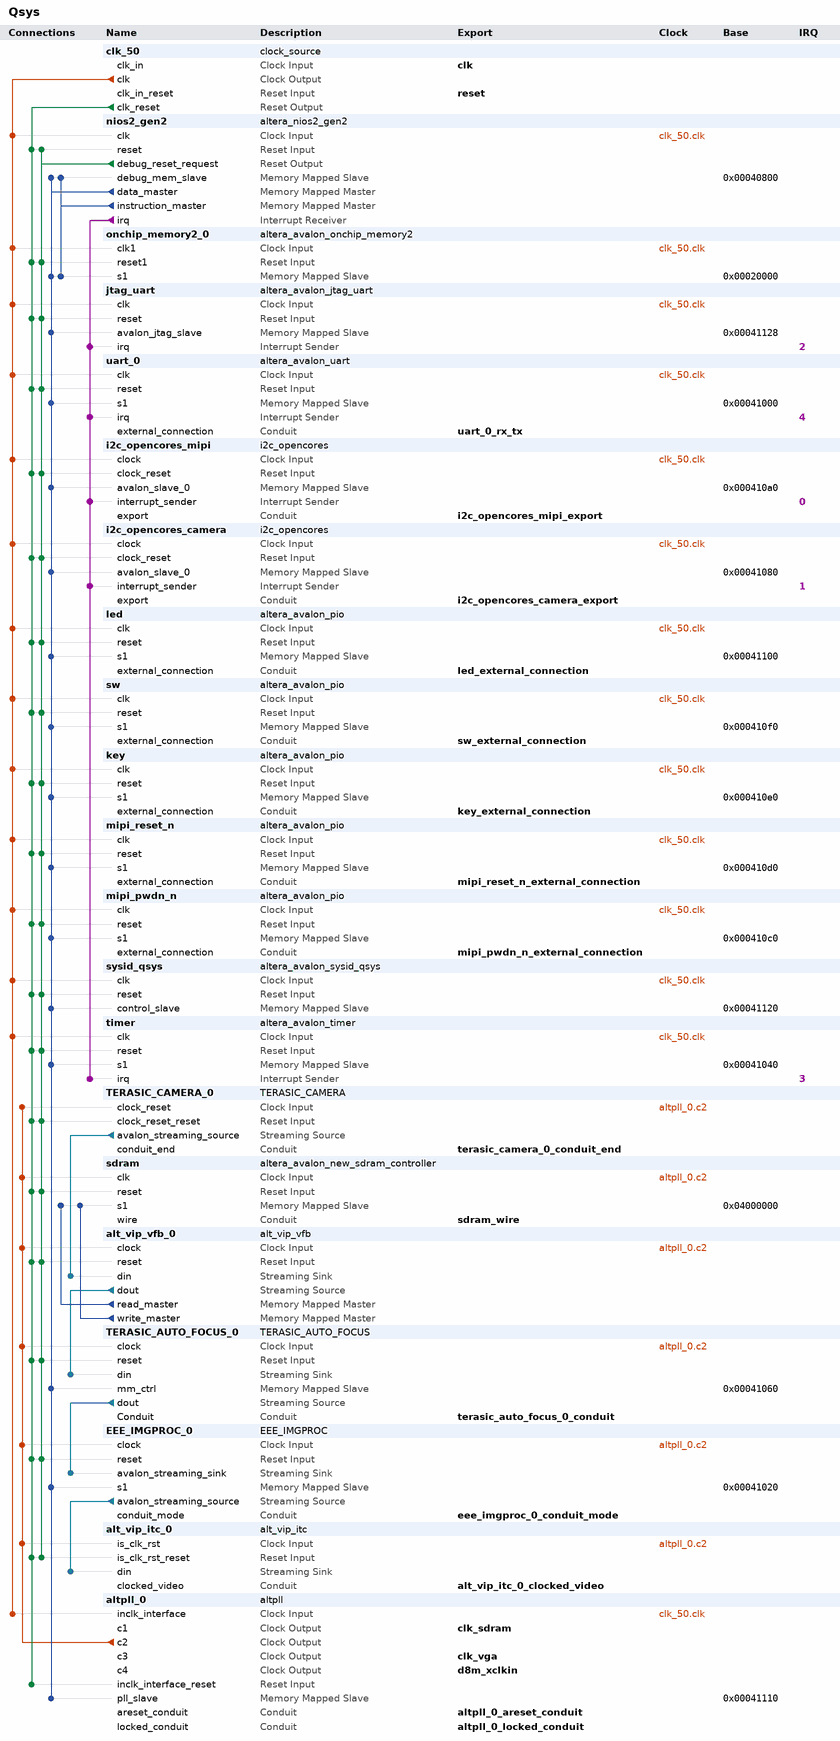
[diagram p0: system contents]
# Platform Designer (Qsys) system Qsys, MAX 10 10M50DAF484C7G
# Parameters at their usual value, and those the tool derives, are not listed.
package require -exact qsys 18.0
create_system Qsys
set_project_property DEVICE_FAMILY {MAX 10}
set_project_property DEVICE 10M50DAF484C7G

add_instance clk_50 clock_source 18.0
set_instance_parameter_value clk_50 clockFrequency 50000000

add_instance nios2_gen2 altera_nios2_gen2 18.0
set_instance_parameter_value nios2_gen2 dcache_size 2048
set_instance_parameter_value nios2_gen2 exceptionSlave onchip_memory2_0.s1
set_instance_parameter_value nios2_gen2 icache_size 4096
set_instance_parameter_value nios2_gen2 impl Fast
set_instance_parameter_value nios2_gen2 resetSlave onchip_memory2_0.s1

add_instance onchip_memory2_0 altera_avalon_onchip_memory2 18.0
set_instance_parameter_value onchip_memory2_0 dataWidth 32
set_instance_parameter_value onchip_memory2_0 dualPort false
set_instance_parameter_value onchip_memory2_0 initMemContent true
set_instance_parameter_value onchip_memory2_0 initializationFileName Qsys_onchip_memory2_0.hex
set_instance_parameter_value onchip_memory2_0 memorySize 131072
set_instance_parameter_value onchip_memory2_0 useNonDefaultInitFile true

add_instance jtag_uart altera_avalon_jtag_uart 18.0
set_instance_parameter_value jtag_uart simInteractiveOptions NO_INTERACTIVE_WINDOWS

add_instance uart_0 altera_avalon_uart 18.0
set_instance_parameter_value uart_0 baud 38400
set_instance_parameter_value uart_0 dataBits 8
set_instance_parameter_value uart_0 fixedBaud true
set_instance_parameter_value uart_0 parity NONE
set_instance_parameter_value uart_0 stopBits 1

add_instance i2c_opencores_mipi i2c_opencores 12.0

add_instance i2c_opencores_camera i2c_opencores 12.0

add_instance led altera_avalon_pio 18.0
set_instance_parameter_value led direction Output
set_instance_parameter_value led width 10

add_instance sw altera_avalon_pio 18.0
set_instance_parameter_value sw direction Input
set_instance_parameter_value sw width 10

add_instance key altera_avalon_pio 18.0
set_instance_parameter_value key direction Input
set_instance_parameter_value key width 2

add_instance mipi_reset_n altera_avalon_pio 18.0
set_instance_parameter_value mipi_reset_n direction Output
set_instance_parameter_value mipi_reset_n width 1

add_instance mipi_pwdn_n altera_avalon_pio 18.0
set_instance_parameter_value mipi_pwdn_n direction Output
set_instance_parameter_value mipi_pwdn_n width 1

add_instance sysid_qsys altera_avalon_sysid_qsys 18.0
set_instance_parameter_value sysid_qsys id 0

add_instance timer altera_avalon_timer 18.0
set_instance_parameter_value timer period 1
set_instance_parameter_value timer periodUnits MSEC

add_instance TERASIC_CAMERA_0 TERASIC_CAMERA 1.0

add_instance sdram altera_avalon_new_sdram_controller 18.0
set_instance_parameter_value sdram TAC 5.5
set_instance_parameter_value sdram TRCD 20.0
set_instance_parameter_value sdram TRP 20.0
set_instance_parameter_value sdram casLatency 3
set_instance_parameter_value sdram columnWidth 10
set_instance_parameter_value sdram dataWidth 16
set_instance_parameter_value sdram generateSimulationModel true
set_instance_parameter_value sdram model single_Micron_MT48LC4M32B2_7_chip
set_instance_parameter_value sdram numberOfBanks 4
set_instance_parameter_value sdram numberOfChipSelects 1
set_instance_parameter_value sdram powerUpDelay 100.0
set_instance_parameter_value sdram refreshPeriod 15.625
set_instance_parameter_value sdram rowWidth 13

add_instance alt_vip_vfb_0 alt_vip_vfb 13.1

add_instance TERASIC_AUTO_FOCUS_0 TERASIC_AUTO_FOCUS 1.0

add_instance EEE_IMGPROC_0 EEE_IMGPROC 1.0

add_instance alt_vip_itc_0 alt_vip_itc 14.0
set_instance_parameter_value alt_vip_itc_0 FIFO_DEPTH 640
set_instance_parameter_value alt_vip_itc_0 H_ACTIVE_PIXELS 640
set_instance_parameter_value alt_vip_itc_0 H_BACK_PORCH 48
set_instance_parameter_value alt_vip_itc_0 H_FRONT_PORCH 16
set_instance_parameter_value alt_vip_itc_0 H_SYNC_LENGTH 96
set_instance_parameter_value alt_vip_itc_0 NUMBER_OF_COLOUR_PLANES 3
set_instance_parameter_value alt_vip_itc_0 THRESHOLD 639
set_instance_parameter_value alt_vip_itc_0 V_ACTIVE_LINES 480
set_instance_parameter_value alt_vip_itc_0 V_BACK_PORCH 33
set_instance_parameter_value alt_vip_itc_0 V_FRONT_PORCH 10
set_instance_parameter_value alt_vip_itc_0 V_SYNC_LENGTH 2

add_instance altpll_0 altpll 18.0
set_instance_parameter_value altpll_0 CLK0_DIVIDE_BY 1
set_instance_parameter_value altpll_0 CLK0_MULTIPLY_BY 2
set_instance_parameter_value altpll_0 CLK1_DIVIDE_BY 1
set_instance_parameter_value altpll_0 CLK1_DUTY_CYCLE 50
set_instance_parameter_value altpll_0 CLK1_MULTIPLY_BY 2
set_instance_parameter_value altpll_0 CLK1_PHASE_SHIFT 7500
set_instance_parameter_value altpll_0 CLK2_DIVIDE_BY 1
set_instance_parameter_value altpll_0 CLK2_DUTY_CYCLE 50
set_instance_parameter_value altpll_0 CLK2_MULTIPLY_BY 2
set_instance_parameter_value altpll_0 CLK2_PHASE_SHIFT 0
set_instance_parameter_value altpll_0 CLK3_DIVIDE_BY 2
set_instance_parameter_value altpll_0 CLK3_DUTY_CYCLE 50
set_instance_parameter_value altpll_0 CLK3_MULTIPLY_BY 1
set_instance_parameter_value altpll_0 CLK3_PHASE_SHIFT 0
set_instance_parameter_value altpll_0 CLK4_DIVIDE_BY 5
set_instance_parameter_value altpll_0 CLK4_DUTY_CYCLE 50
set_instance_parameter_value altpll_0 CLK4_MULTIPLY_BY 2
set_instance_parameter_value altpll_0 CLK4_PHASE_SHIFT 0
set_instance_parameter_value altpll_0 INCLK0_INPUT_FREQUENCY 20000
set_instance_parameter_value altpll_0 PORT_ARESET PORT_USED
set_instance_parameter_value altpll_0 PORT_LOCKED PORT_USED
set_instance_parameter_value altpll_0 PORT_clk1 PORT_USED
set_instance_parameter_value altpll_0 PORT_clk2 PORT_USED
set_instance_parameter_value altpll_0 PORT_clk3 PORT_USED
set_instance_parameter_value altpll_0 PORT_clk4 PORT_USED

# connections
add_connection altpll_0.c2 alt_vip_itc_0.is_clk_rst clock
add_connection altpll_0.c2 alt_vip_vfb_0.clock clock
add_connection altpll_0.c2 EEE_IMGPROC_0.clock clock
add_connection altpll_0.c2 sdram.clk clock
add_connection altpll_0.c2 TERASIC_AUTO_FOCUS_0.clock clock
add_connection altpll_0.c2 TERASIC_CAMERA_0.clock_reset clock
add_connection clk_50.clk altpll_0.inclk_interface clock
add_connection clk_50.clk i2c_opencores_camera.clock clock
add_connection clk_50.clk i2c_opencores_mipi.clock clock
add_connection clk_50.clk jtag_uart.clk clock
add_connection clk_50.clk key.clk clock
add_connection clk_50.clk led.clk clock
add_connection clk_50.clk mipi_pwdn_n.clk clock
add_connection clk_50.clk mipi_reset_n.clk clock
add_connection clk_50.clk nios2_gen2.clk clock
add_connection clk_50.clk onchip_memory2_0.clk1 clock
add_connection clk_50.clk sw.clk clock
add_connection clk_50.clk sysid_qsys.clk clock
add_connection clk_50.clk timer.clk clock
add_connection clk_50.clk uart_0.clk clock
add_connection clk_50.clk_reset alt_vip_itc_0.is_clk_rst_reset reset
add_connection clk_50.clk_reset alt_vip_vfb_0.reset reset
add_connection clk_50.clk_reset altpll_0.inclk_interface_reset reset
add_connection clk_50.clk_reset EEE_IMGPROC_0.reset reset
add_connection clk_50.clk_reset i2c_opencores_camera.clock_reset reset
add_connection clk_50.clk_reset i2c_opencores_mipi.clock_reset reset
add_connection clk_50.clk_reset jtag_uart.reset reset
add_connection clk_50.clk_reset key.reset reset
add_connection clk_50.clk_reset led.reset reset
add_connection clk_50.clk_reset mipi_pwdn_n.reset reset
add_connection clk_50.clk_reset mipi_reset_n.reset reset
add_connection clk_50.clk_reset nios2_gen2.reset reset
add_connection clk_50.clk_reset onchip_memory2_0.reset1 reset
add_connection clk_50.clk_reset sdram.reset reset
add_connection clk_50.clk_reset sw.reset reset
add_connection clk_50.clk_reset sysid_qsys.reset reset
add_connection clk_50.clk_reset TERASIC_AUTO_FOCUS_0.reset reset
add_connection clk_50.clk_reset TERASIC_CAMERA_0.clock_reset_reset reset
add_connection clk_50.clk_reset timer.reset reset
add_connection clk_50.clk_reset uart_0.reset reset
add_connection nios2_gen2.debug_reset_request alt_vip_itc_0.is_clk_rst_reset reset
add_connection nios2_gen2.debug_reset_request alt_vip_vfb_0.reset reset
add_connection nios2_gen2.debug_reset_request EEE_IMGPROC_0.reset reset
add_connection nios2_gen2.debug_reset_request i2c_opencores_camera.clock_reset reset
add_connection nios2_gen2.debug_reset_request i2c_opencores_mipi.clock_reset reset
add_connection nios2_gen2.debug_reset_request jtag_uart.reset reset
add_connection nios2_gen2.debug_reset_request key.reset reset
add_connection nios2_gen2.debug_reset_request led.reset reset
add_connection nios2_gen2.debug_reset_request mipi_pwdn_n.reset reset
add_connection nios2_gen2.debug_reset_request mipi_reset_n.reset reset
add_connection nios2_gen2.debug_reset_request nios2_gen2.reset reset
add_connection nios2_gen2.debug_reset_request onchip_memory2_0.reset1 reset
add_connection nios2_gen2.debug_reset_request sdram.reset reset
add_connection nios2_gen2.debug_reset_request sw.reset reset
add_connection nios2_gen2.debug_reset_request sysid_qsys.reset reset
add_connection nios2_gen2.debug_reset_request TERASIC_AUTO_FOCUS_0.reset reset
add_connection nios2_gen2.debug_reset_request TERASIC_CAMERA_0.clock_reset_reset reset
add_connection nios2_gen2.debug_reset_request timer.reset reset
add_connection nios2_gen2.debug_reset_request uart_0.reset reset
add_connection alt_vip_vfb_0.read_master sdram.s1 avalon
set_connection_parameter_value alt_vip_vfb_0.read_master/sdram.s1 arbitrationPriority 50
set_connection_parameter_value alt_vip_vfb_0.read_master/sdram.s1 baseAddress 0x04000000
add_connection alt_vip_vfb_0.write_master sdram.s1 avalon
set_connection_parameter_value alt_vip_vfb_0.write_master/sdram.s1 arbitrationPriority 30
set_connection_parameter_value alt_vip_vfb_0.write_master/sdram.s1 baseAddress 0x04000000
add_connection nios2_gen2.data_master altpll_0.pll_slave avalon
set_connection_parameter_value nios2_gen2.data_master/altpll_0.pll_slave baseAddress 0x00041110
add_connection nios2_gen2.data_master EEE_IMGPROC_0.s1 avalon
set_connection_parameter_value nios2_gen2.data_master/EEE_IMGPROC_0.s1 baseAddress 0x00041020
add_connection nios2_gen2.data_master i2c_opencores_camera.avalon_slave_0 avalon
set_connection_parameter_value nios2_gen2.data_master/i2c_opencores_camera.avalon_slave_0 baseAddress 0x00041080
add_connection nios2_gen2.data_master i2c_opencores_mipi.avalon_slave_0 avalon
set_connection_parameter_value nios2_gen2.data_master/i2c_opencores_mipi.avalon_slave_0 baseAddress 0x000410a0
add_connection nios2_gen2.data_master jtag_uart.avalon_jtag_slave avalon
set_connection_parameter_value nios2_gen2.data_master/jtag_uart.avalon_jtag_slave baseAddress 0x00041128
add_connection nios2_gen2.data_master key.s1 avalon
set_connection_parameter_value nios2_gen2.data_master/key.s1 baseAddress 0x000410e0
add_connection nios2_gen2.data_master led.s1 avalon
set_connection_parameter_value nios2_gen2.data_master/led.s1 baseAddress 0x00041100
add_connection nios2_gen2.data_master mipi_pwdn_n.s1 avalon
set_connection_parameter_value nios2_gen2.data_master/mipi_pwdn_n.s1 baseAddress 0x000410c0
add_connection nios2_gen2.data_master mipi_reset_n.s1 avalon
set_connection_parameter_value nios2_gen2.data_master/mipi_reset_n.s1 baseAddress 0x000410d0
add_connection nios2_gen2.data_master nios2_gen2.debug_mem_slave avalon
set_connection_parameter_value nios2_gen2.data_master/nios2_gen2.debug_mem_slave baseAddress 0x00040800
add_connection nios2_gen2.data_master onchip_memory2_0.s1 avalon
set_connection_parameter_value nios2_gen2.data_master/onchip_memory2_0.s1 baseAddress 0x00020000
add_connection nios2_gen2.data_master sw.s1 avalon
set_connection_parameter_value nios2_gen2.data_master/sw.s1 baseAddress 0x000410f0
add_connection nios2_gen2.data_master sysid_qsys.control_slave avalon
set_connection_parameter_value nios2_gen2.data_master/sysid_qsys.control_slave baseAddress 0x00041120
add_connection nios2_gen2.data_master TERASIC_AUTO_FOCUS_0.mm_ctrl avalon
set_connection_parameter_value nios2_gen2.data_master/TERASIC_AUTO_FOCUS_0.mm_ctrl baseAddress 0x00041060
add_connection nios2_gen2.data_master timer.s1 avalon
set_connection_parameter_value nios2_gen2.data_master/timer.s1 baseAddress 0x00041040
add_connection nios2_gen2.data_master uart_0.s1 avalon
set_connection_parameter_value nios2_gen2.data_master/uart_0.s1 baseAddress 0x00041000
add_connection nios2_gen2.instruction_master nios2_gen2.debug_mem_slave avalon
set_connection_parameter_value nios2_gen2.instruction_master/nios2_gen2.debug_mem_slave baseAddress 0x00040800
add_connection nios2_gen2.instruction_master onchip_memory2_0.s1 avalon
set_connection_parameter_value nios2_gen2.instruction_master/onchip_memory2_0.s1 baseAddress 0x00020000
add_connection alt_vip_vfb_0.dout TERASIC_AUTO_FOCUS_0.din avalon_streaming
add_connection EEE_IMGPROC_0.avalon_streaming_source alt_vip_itc_0.din avalon_streaming
add_connection TERASIC_AUTO_FOCUS_0.dout EEE_IMGPROC_0.avalon_streaming_sink avalon_streaming
add_connection TERASIC_CAMERA_0.avalon_streaming_source alt_vip_vfb_0.din avalon_streaming
add_connection nios2_gen2.irq i2c_opencores_camera.interrupt_sender interrupt
set_connection_parameter_value nios2_gen2.irq/i2c_opencores_camera.interrupt_sender irqNumber 1
add_connection nios2_gen2.irq i2c_opencores_mipi.interrupt_sender interrupt
set_connection_parameter_value nios2_gen2.irq/i2c_opencores_mipi.interrupt_sender irqNumber 0
add_connection nios2_gen2.irq jtag_uart.irq interrupt
set_connection_parameter_value nios2_gen2.irq/jtag_uart.irq irqNumber 2
add_connection nios2_gen2.irq timer.irq interrupt
set_connection_parameter_value nios2_gen2.irq/timer.irq irqNumber 3
add_connection nios2_gen2.irq uart_0.irq interrupt
set_connection_parameter_value nios2_gen2.irq/uart_0.irq irqNumber 4

# exported interfaces
add_interface alt_vip_itc_0_clocked_video conduit end
set_interface_property alt_vip_itc_0_clocked_video EXPORT_OF alt_vip_itc_0.clocked_video
add_interface altpll_0_areset_conduit conduit end
set_interface_property altpll_0_areset_conduit EXPORT_OF altpll_0.areset_conduit
add_interface altpll_0_locked_conduit conduit end
set_interface_property altpll_0_locked_conduit EXPORT_OF altpll_0.locked_conduit
add_interface clk clock sink
set_interface_property clk EXPORT_OF clk_50.clk_in
add_interface clk_sdram clock source
set_interface_property clk_sdram EXPORT_OF altpll_0.c1
add_interface clk_vga clock source
set_interface_property clk_vga EXPORT_OF altpll_0.c3
add_interface d8m_xclkin clock source
set_interface_property d8m_xclkin EXPORT_OF altpll_0.c4
add_interface eee_imgproc_0_conduit_mode conduit end
set_interface_property eee_imgproc_0_conduit_mode EXPORT_OF EEE_IMGPROC_0.conduit_mode
add_interface i2c_opencores_camera_export conduit end
set_interface_property i2c_opencores_camera_export EXPORT_OF i2c_opencores_camera.export
add_interface i2c_opencores_mipi_export conduit end
set_interface_property i2c_opencores_mipi_export EXPORT_OF i2c_opencores_mipi.export
add_interface key_external_connection conduit end
set_interface_property key_external_connection EXPORT_OF key.external_connection
add_interface led_external_connection conduit end
set_interface_property led_external_connection EXPORT_OF led.external_connection
add_interface mipi_pwdn_n_external_connection conduit end
set_interface_property mipi_pwdn_n_external_connection EXPORT_OF mipi_pwdn_n.external_connection
add_interface mipi_reset_n_external_connection conduit end
set_interface_property mipi_reset_n_external_connection EXPORT_OF mipi_reset_n.external_connection
add_interface reset reset sink
set_interface_property reset EXPORT_OF clk_50.clk_in_reset
add_interface sdram_wire conduit end
set_interface_property sdram_wire EXPORT_OF sdram.wire
add_interface sw_external_connection conduit end
set_interface_property sw_external_connection EXPORT_OF sw.external_connection
add_interface terasic_auto_focus_0_conduit conduit end
set_interface_property terasic_auto_focus_0_conduit EXPORT_OF TERASIC_AUTO_FOCUS_0.Conduit
add_interface terasic_camera_0_conduit_end conduit end
set_interface_property terasic_camera_0_conduit_end EXPORT_OF TERASIC_CAMERA_0.conduit_end
add_interface uart_0_rx_tx conduit end
set_interface_property uart_0_rx_tx EXPORT_OF uart_0.external_connection

set_interconnect_requirement {$system} qsys_mm.clockCrossingAdapter HANDSHAKE
set_interconnect_requirement {$system} qsys_mm.enableEccProtection FALSE
set_interconnect_requirement {$system} qsys_mm.insertDefaultSlave FALSE
set_interconnect_requirement {$system} qsys_mm.maxAdditionalLatency 1

save_system Qsys.qsys
